# Altium schematic sheet Sheet1.SchDoc
size A4; SheetNumber: 1; SheetTotal: 1
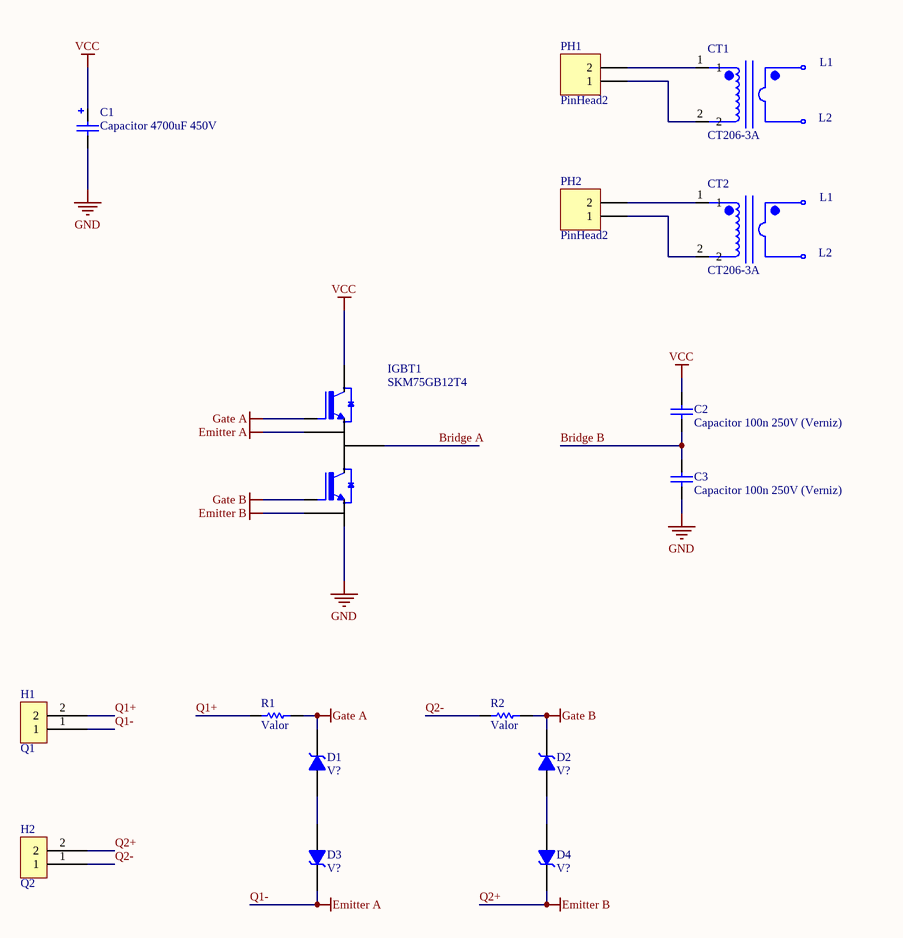
[diagram p0: Sheet1.SchDoc]

## Parts
C1  Capacitor 4700uF 450V  [Capacitor 4700uF 450V RIFA]
C2  Capacitor 100n 250V (Verniz)  [Capacitor 100n (cor verniz)]
C3  Capacitor 100n 250V (Verniz)  [Capacitor 100n (cor verniz)]
CT1  CT206-3A  [CT206-3A]
CT2  CT206-3A  [CT206-3A]
D1  V?  [SOD-80]
D2  V?  [SOD-80]
D3  V?  [SOD-80]
D4  V?  [SOD-80]
H1  Q1  [Pin Socket 1x2 TH Pitch 2.54mm]
H2  Q2  [Pin Socket 1x2 TH Pitch 2.54mm]
IGBT1  SKM75GB12T4  [SEMIKRON SKM75GB12T4]
PH1  PinHead2  [PinHead2]
PH2  PinHead2  [PinHead2]
R1  Valor  [RES_AXIAL_1W]
R2  Valor  [RES_AXIAL_1W]

## Nets
Gate A: D1.K IGBT1.4(G1) R1.2
Gate B: D2.K IGBT1.6(G2) R2.2
GND: C1.1 C3.1 IGBT1.2(C)
Q1-: D3.K H1.1 IGBT1.5(E1)  [also labelled Emitter A]
Q2+: D4.K H2.2 IGBT1.7(E2)  [also labelled Emitter B]
VCC: C1.2 C2.2 IGBT1.3(E)
Bridge A: IGBT1.1(E1)
Bridge B: C2.1 C3.2
Q1+: H1.2 R1.1
Q2-: H2.1 R2.1
NetCT1_1: CT1.1 PH1.2
NetCT1_2: CT1.2 PH1.1
NetCT2_1: CT2.1 PH2.2
NetCT2_2: CT2.2 PH2.1
NetD1_A: D1.A D3.A
NetD2_A: D2.A D4.A

## Notes on the sheet
- (in symbol CT206-3A) L1; L2

## Library data of the parts
CT1 CT2 = CT206-3A: PTH Current Transformer
D1-D4 = Zener: Diodo zener
H1 H2 = HEADER_SOCKET_2: Socket to header connector with 2 pins
R1 R2 = Resistor